# Altium schematic sheet Main.SchDoc
size A4; SheetNumber: 1; SheetTotal: 3
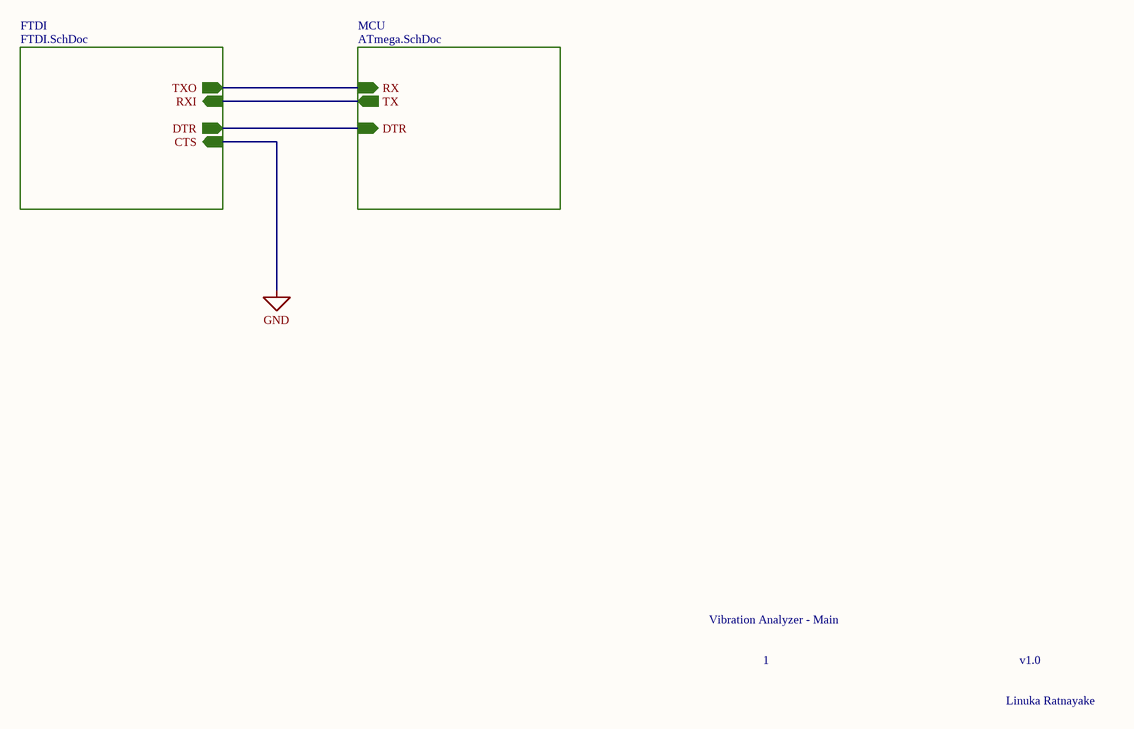
[diagram p0: Main.SchDoc]

## Sub-sheets
FTDI = FTDI.SchDoc: TXO (out), RXI (in), CTS (in), DTR (out)
MCU = ATmega.SchDoc: DTR (in), RX (in), TX (out)

## Nets
GND: sheet FTDI/CTS
(unnamed): sheet MCU/DTR, sheet FTDI/DTR
(unnamed): sheet MCU/RX, sheet FTDI/TXO
(unnamed): sheet MCU/TX, sheet FTDI/RXI

## Notes on the sheet
- Vibration Analyzer - Main
- 1
- v1.0
- Linuka Ratnayake